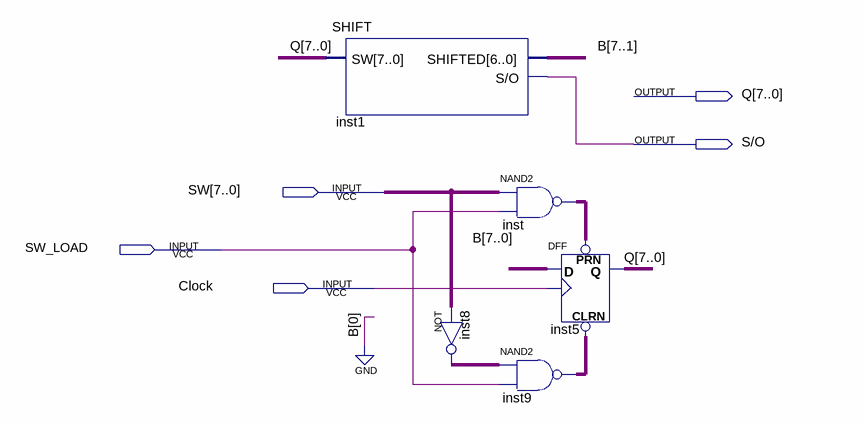
[diagram p0: schematic sheet]
// Quartus schematic PISO.bdf as structural Verilog: 5 symbols, 5 pins
module PISO (
  input  [7:0] SW,
  input  SW_LOAD,
  input  Clock,
  output [7:0] Q,
  output \S/O 
);

  wire [7:0] inst8_out, inst9_out, inst_out;
  wire [7:1] B;

  SHIFT inst1 (.SW(Q), .SHIFTED(B), .\S/O (\S/O ));
  assign inst8_out = ~SW;  // NOT inst8, 8 bits wide
  assign inst_out = ~(SW & {8{SW_LOAD}});  // NAND2 inst, 8 bits wide
  assign inst9_out = ~(inst8_out & {8{SW_LOAD}});  // NAND2 inst9, 8 bits wide
  DFF inst5[7:0] (.CLRN(inst9_out), .CLK(Clock), .D({B, 1'b0}), .PRN(inst_out), .Q(Q));
endmodule
